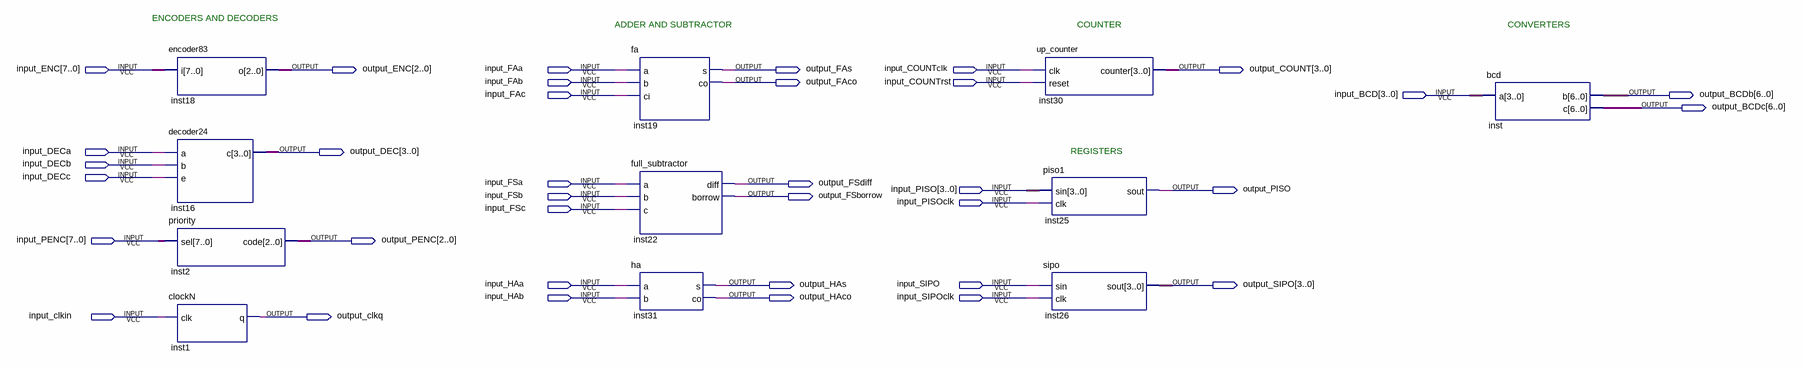
[diagram p0: schematic sheet]
// Quartus schematic TopSchematic2.bdf as structural Verilog: 11 symbols, 36 pins
module TopSchematic2 (
  input  [7:0] input_ENC,
  input  input_FAa,
  input  input_COUNTclk,
  input  input_FAb,
  input  input_COUNTrst,
  input  input_FAc,
  input  [3:0] input_BCD,
  input  input_DECa,
  input  input_DECb,
  input  input_DECc,
  input  input_FSa,
  input  [3:0] input_PISO,
  input  input_FSb,
  input  input_PISOclk,
  input  input_FSc,
  input  [7:0] input_PENC,
  input  input_HAa,
  input  input_SIPO,
  input  input_HAb,
  input  input_SIPOclk,
  input  input_clkin,
  output [2:0] output_ENC,
  output output_FAs,
  output [3:0] output_COUNT,
  output output_FAco,
  output [6:0] output_BCDb,
  output [6:0] output_BCDc,
  output [3:0] output_DEC,
  output output_FSdiff,
  output output_PISO,
  output output_FSborrow,
  output [2:0] output_PENC,
  output output_HAs,
  output [3:0] output_SIPO,
  output output_HAco,
  output output_clkq
);

  encoder83 inst18 (.i(input_ENC), .o(output_ENC));
  decoder24 inst16 (.a(input_DECa), .b(input_DECb), .e(input_DECc), .c(output_DEC));
  \priority  inst2 (.sel(input_PENC), .code(output_PENC));
  clockN inst1 (.clk(input_clkin), .q(output_clkq));
  fa inst19 (.a(input_FAa), .b(input_FAb), .ci(input_FAc), .s(output_FAs), .co(output_FAco));
  full_subtractor inst22 (.a(input_FSa), .b(input_FSb), .c(input_FSc), .diff(output_FSdiff), .borrow(output_FSborrow));
  ha inst31 (.a(input_HAa), .b(input_HAb), .s(output_HAs), .co(output_HAco));
  up_counter inst30 (.clk(input_COUNTclk), .reset(input_COUNTrst), .counter(output_COUNT));
  piso1 inst25 (.sin(input_PISO), .clk(input_PISOclk), .sout(output_PISO));
  sipo inst26 (.sin(input_SIPO), .clk(input_SIPOclk), .sout(output_SIPO));
  bcd inst (.a(input_BCD), .b(output_BCDb), .c(output_BCDc));

  // Notes on the sheet:
  //   ENCODERS AND DECODERS
  //   ADDER AND SUBTRACTOR
  //   COUNTER
  //   CONVERTERS
  //   REGISTERS
endmodule
